# EAGLE schematic CHIP_1_0 (EAGLE 6.6.0)
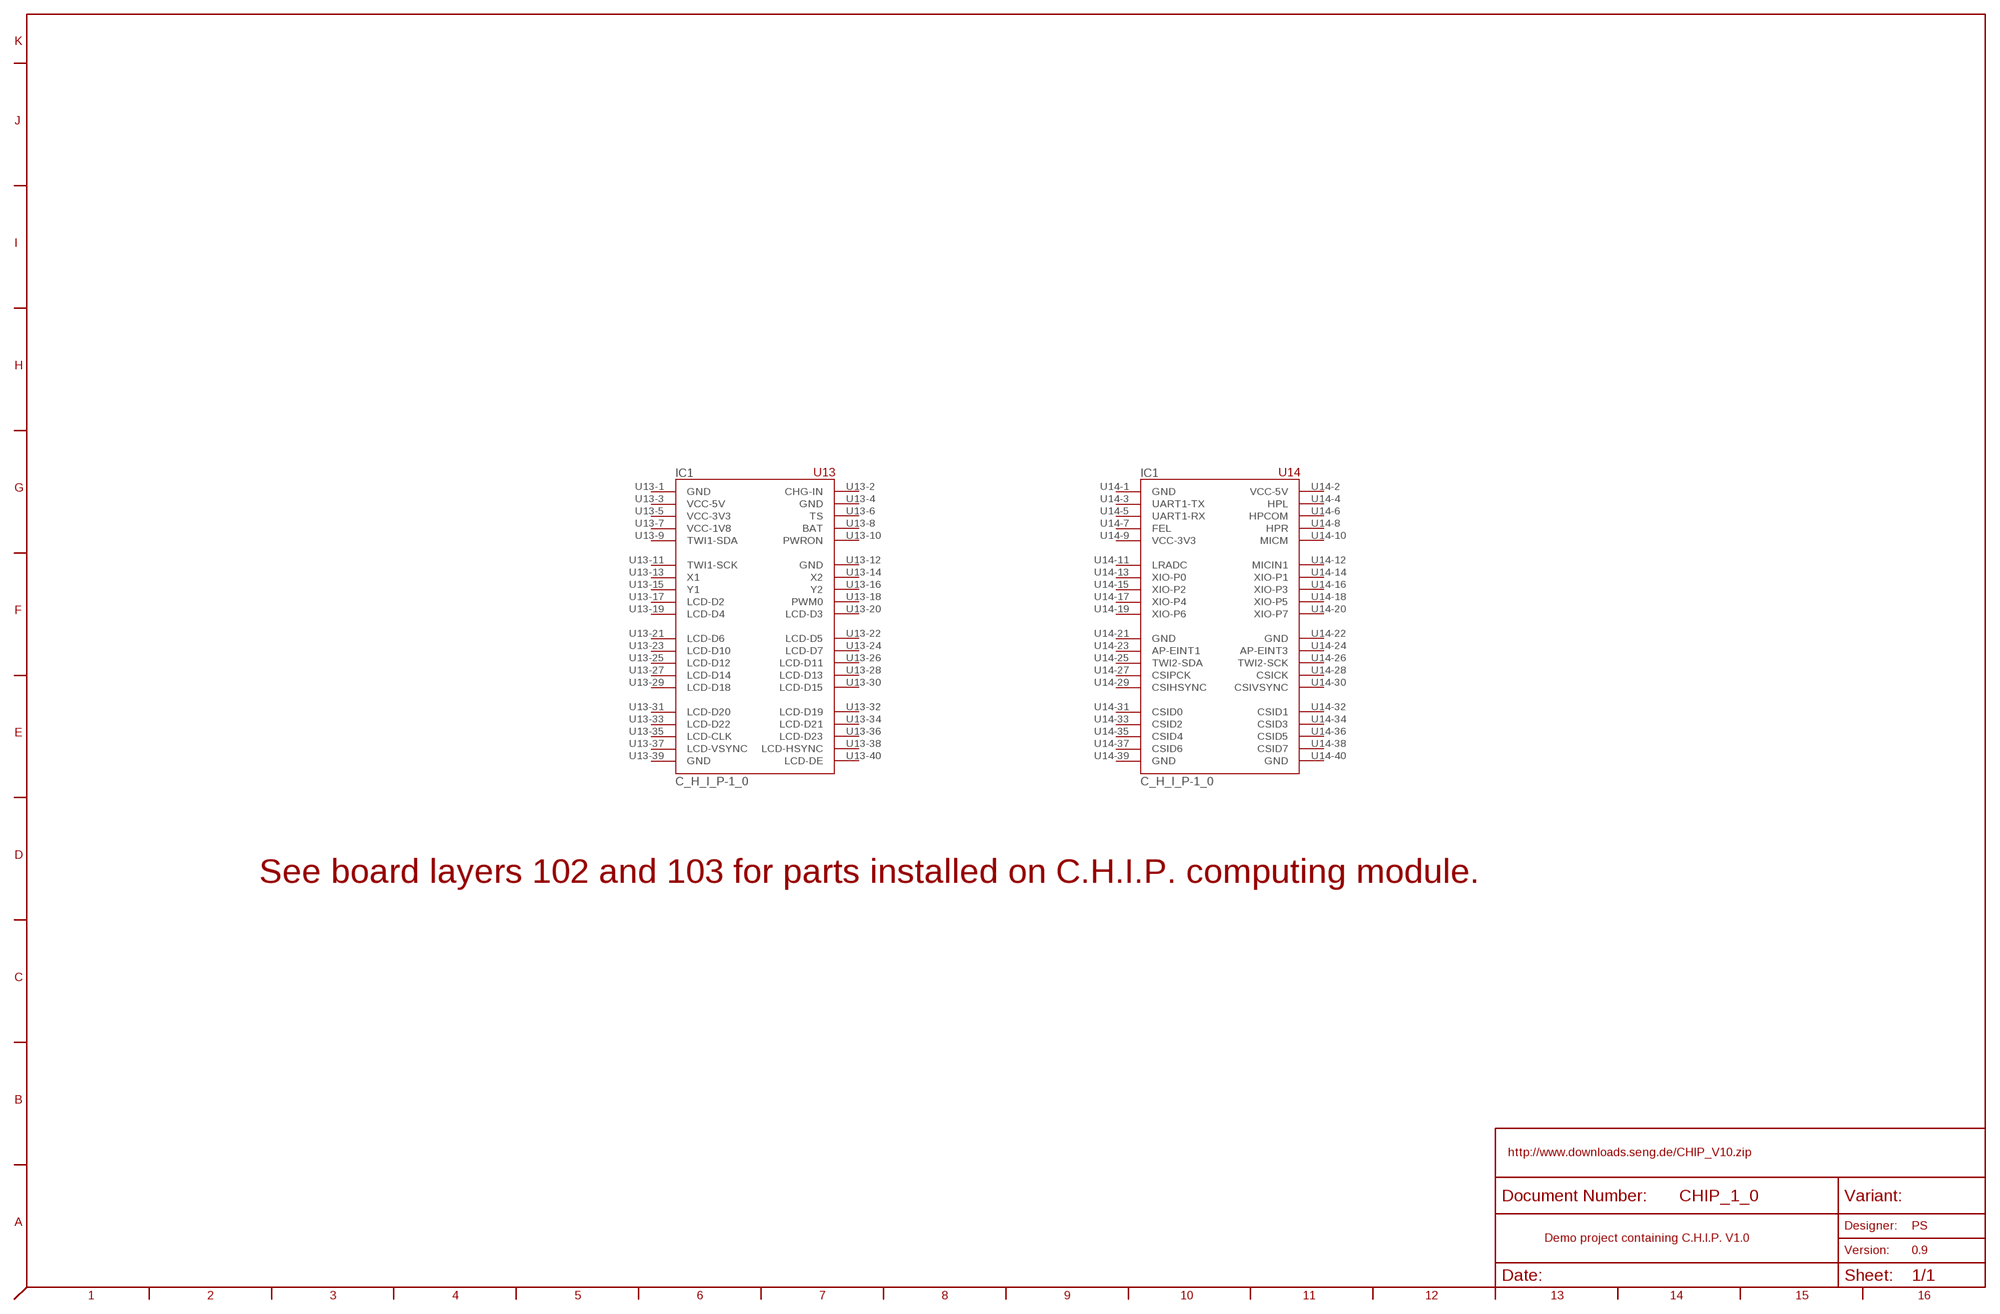
[diagram p0: schematic, sheet 1]
DOC1 (DOC_RAHMENA3Q): VALUE: Fuelltext
DOC2 (DOC_FIELD): VALUE: Fuelltext

## Parts
IC1  C_H_I_P-1_0  [C_H_I_P-1_0]
Unconnected: IC1.U13-3(VCC-5V) IC1.U13-5(VCC-3V3) IC1.U13-6(TS) IC1.U13-7(VCC-1V8) IC1.U13-9(TWI1-SDA) IC1.U13-10(PWRON) IC1.U13-11(TWI1-SCK) IC1.U13-13(X1) IC1.U13-14(X2) IC1.U13-15(Y1) IC1.U13-16(Y2) IC1.U13-17(LCD-D2) IC1.U13-18(PWM0) IC1.U13-19(LCD-D4) IC1.U13-20(LCD-D3) IC1.U13-21(LCD-D6) IC1.U13-22(LCD-D5) IC1.U13-23(LCD-D10) IC1.U13-24(LCD-D7) IC1.U13-25(LCD-D12) IC1.U13-26(LCD-D11) IC1.U13-27(LCD-D14) IC1.U13-28(LCD-D13) IC1.U13-29(LCD-D18) IC1.U13-30(LCD-D15) IC1.U13-31(LCD-D20) IC1.U13-32(LCD-D19) IC1.U13-33(LCD-D22) IC1.U13-34(LCD-D21) IC1.U13-35(LCD-CLK) IC1.U13-36(LCD-D23) IC1.U13-37(LCD-VSYNC) IC1.U13-38(LCD-HSYNC) IC1.U13-40(LCD-DE) IC1.U14-2(VCC-5V) IC1.U14-3(UART1-TX) IC1.U14-4(HPL) IC1.U14-5(UART1-RX) IC1.U14-6(HPCOM) IC1.U14-7(FEL) IC1.U14-8(HPR) IC1.U14-9(VCC-3V3) IC1.U14-10(MICM) IC1.U14-11(LRADC) IC1.U14-12(MICIN1) IC1.U14-13(XIO-P0) IC1.U14-14(XIO-P1) IC1.U14-15(XIO-P2) IC1.U14-16(XIO-P3) IC1.U14-17(XIO-P4) IC1.U14-18(XIO-P5) IC1.U14-19(XIO-P6) IC1.U14-20(XIO-P7) IC1.U14-23(AP-EINT1) IC1.U14-24(AP-EINT3) IC1.U14-25(TWI2-SDA) IC1.U14-26(TWI2-SCK) IC1.U14-27(CSIPCK) IC1.U14-28(CSICK) IC1.U14-29(CSIHSYNC) IC1.U14-30(CSIVSYNC) IC1.U14-31(CSID0) IC1.U14-32(CSID1) IC1.U14-33(CSID2) IC1.U14-34(CSID3) IC1.U14-35(CSID4) IC1.U14-36(CSID5) IC1.U14-37(CSID6) IC1.U14-38(CSID7)

## Notes on the sheet
- See board layers 102 and 103 for parts installed on C.H.I.P. computing module.
- http://www.downloads.seng.de/CHIP_V10.zip
- PS
- Demo project containing C.H.I.P. V1.0
- 0.9

## Power pins joined to a net without a drawn wire
BAT: IC1.U13-8(BAT)
CHG-IN: IC1.U13-2(CHG-IN)
GND: IC1.U13-1(GND) IC1.U13-4(GND) IC1.U13-12(GND) IC1.U13-39(GND) IC1.U14-1(GND) IC1.U14-21(GND) IC1.U14-22(GND) IC1.U14-39(GND) IC1.U14-40(GND)

## Library data of the parts
IC1 = SENG:C_H_I_P-1_0: C.H.I.P. 1.0 Linux computer module with on chip power management unit